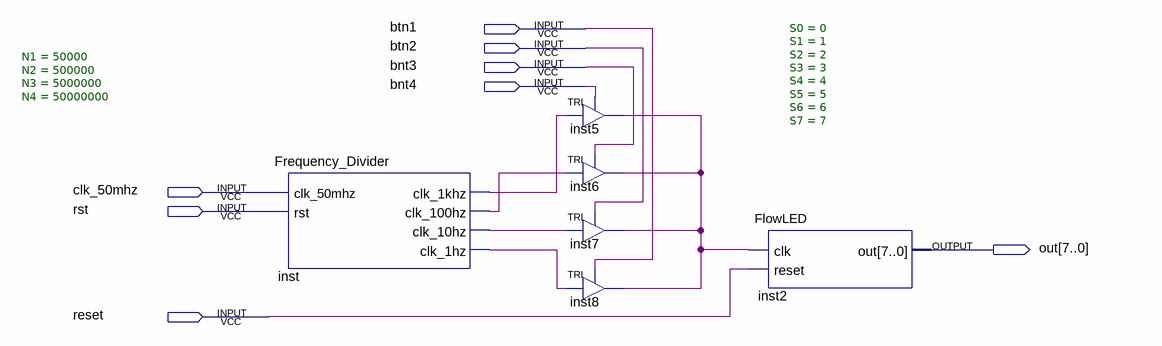
[diagram p0: schematic sheet]
// Quartus schematic Block1.bdf as structural Verilog: 6 symbols, 8 pins
module Block1 (
  input  btn1,
  input  btn2,
  input  bnt3,
  input  bnt4,
  input  clk_50mhz,
  input  rst,
  input  reset,
  output [7:0] out
);

  wire inst5_out, inst_clk_1hz, inst_clk_1khz, inst_clk_10hz, inst_clk_100hz;

  Frequency_Divider #(.N1(50000), .N2(500000), .N3(5000000), .N4(50000000)) inst (
    .clk_50mhz(clk_50mhz), .rst(rst), .clk_1khz(inst_clk_1khz), .clk_100hz(inst_clk_100hz),
    .clk_10hz(inst_clk_10hz), .clk_1hz(inst_clk_1hz));
  TRI inst5 (.IN(inst_clk_1khz), .OE(bnt4), .OUT(inst5_out));
  TRI inst6 (.IN(inst_clk_100hz), .OE(bnt3), .OUT(inst5_out));
  TRI inst7 (.IN(inst_clk_10hz), .OE(btn2), .OUT(inst5_out));
  TRI inst8 (.IN(inst_clk_1hz), .OE(btn1), .OUT(inst5_out));
  FlowLED #(.S0(0), .S1(1), .S2(2), .S3(3), .S4(4), .S5(5), .S6(6), .S7(7)) inst2 (
    .clk(inst5_out), .reset(reset), .out(out));
endmodule
